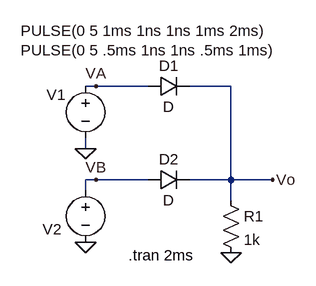
[diagram p0: schematic DASE TP 2 PUNTO 5.asc]
DASE TP 2 PUNTO 5.asc, the LTspice schematic file:
Version 4
SHEET 1 880 680
WIRE 80 112 64 112
WIRE 160 112 80 112
WIRE 288 112 224 112
WIRE 64 208 64 192
WIRE 80 256 64 256
WIRE 160 256 80 256
WIRE 288 256 288 112
WIRE 288 256 224 256
WIRE 352 256 288 256
WIRE 64 272 64 256
WIRE 288 288 288 256
FLAG 352 256 Vo
FLAG 64 208 0
FLAG 64 352 0
FLAG 288 368 0
FLAG 80 112 VA
FLAG 80 256 VB
SYMBOL voltage 64 96 R0
WINDOW 0 -60 29 Left 2
WINDOW 3 -100 -39 Left 2
WINDOW 123 0 0 Left 0
WINDOW 39 0 0 Left 0
SYMATTR InstName V1
SYMATTR Value PULSE(0 5 .5ms 1ns 1ns .5ms 1ms)
SYMBOL voltage 64 256 R0
WINDOW 0 -66 76 Left 2
WINDOW 3 -100 -229 Left 2
WINDOW 123 0 0 Left 0
WINDOW 39 0 0 Left 0
SYMATTR InstName V2
SYMATTR Value PULSE(0 5 1ms 1ns 1ns 1ms 2ms)
SYMBOL diode 160 128 R270
WINDOW 0 32 32 VTop 2
WINDOW 3 0 32 VBottom 2
SYMATTR InstName D1
SYMBOL diode 160 272 R270
WINDOW 0 32 32 VTop 2
WINDOW 3 0 32 VBottom 2
SYMATTR InstName D2
SYMBOL res 272 272 R0
SYMATTR InstName R1
SYMATTR Value 1k
TEXT 130 372 Left 2 !.tran 2ms

The netlist it stands for:
* DASE TP 2 PUNTO 5.asc
V1 VA 0 PULSE(0 5 .5ms 1ns 1ns .5ms 1ms)
V2 VB 0 PULSE(0 5 1ms 1ns 1ns 1ms 2ms)
D1 VA Vo D
D2 VB Vo D
R1 Vo 0 1k
.model D D
.lib standard.dio
.tran 2ms
.backanno
.end